# Altium schematic sheet Sheet3.SchDoc
size A4; SheetNumber: 3; SheetTotal: 3
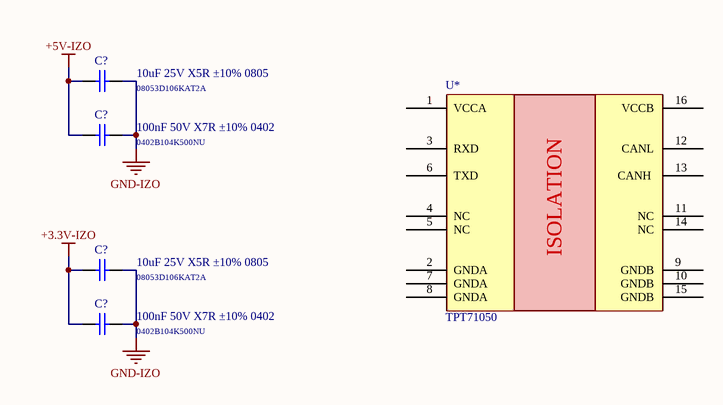
[diagram p0: Sheet3.SchDoc]

## Parts
(Parts that share a designator on the sheet are numbered #1, #2 ... from top to bottom, then left to right.)
C?#1  10uF 25V X5R ±10% 0805  Name: 08053D106KAT2A  [0805]
C?#2  100nF 50V X7R ±10% 0402  Name: 0402B104K500NU  [0402]
C?#3  10uF 25V X5R ±10% 0805  Name: 08053D106KAT2A  [0805]
C?#4  100nF 50V X7R ±10% 0402  Name: 0402B104K500NU  [0402]
U*  TPT71050  [SOIC127P1040X265-16N]

## Nets
+3.3V-IZO: C?#3.1 C?#4.1
+5V-IZO: C?#1.1 C?#2.1
GND-IZO: C?#1.2 C?#2.2 C?#3.2 C?#4.2

Not connected (* = marked no-connect by the designer): U* 1(VCCA) 2(GNDA) 3(RXD) 6(TXD) 7(GNDA) 8(GNDA) 9(GNDB) 10(GNDB) 11(NC) 12(CANL) 13(CANH_) 14(NC) 15(GNDB) 16(VCCB)  4(NC)  5(NC)

## Notes on the sheet
- (in symbol TPT71050) ISOLATION

## Library data of the parts
C?#1 C?#3 = Capacitor ceramic: Ceramic capacitor; Manufacturer: Kyocera; Voltage: 25V; Tolerance: ±10%; Capacitance: 10uF; Dielectric: X5R; BOMString: =Capacitance+' '+Voltage+' '+Tolerance+' '+Footprint; HelpURL: *; Supplier: *
C?#2 C?#4 = Capacitor ceramic: Ceramic capacitor; Manufacturer: Hitano; Voltage: 50V; Tolerance: ±10%; Capacitance: 100nF; Dielectric: X7R; BOMString: =Capacitance+' '+Voltage+' '+Tolerance+' '+Footprint; HelpURL: *; Supplier: *